# EAGLE design DIGI PTT CW (EAGLE 7.6.0)
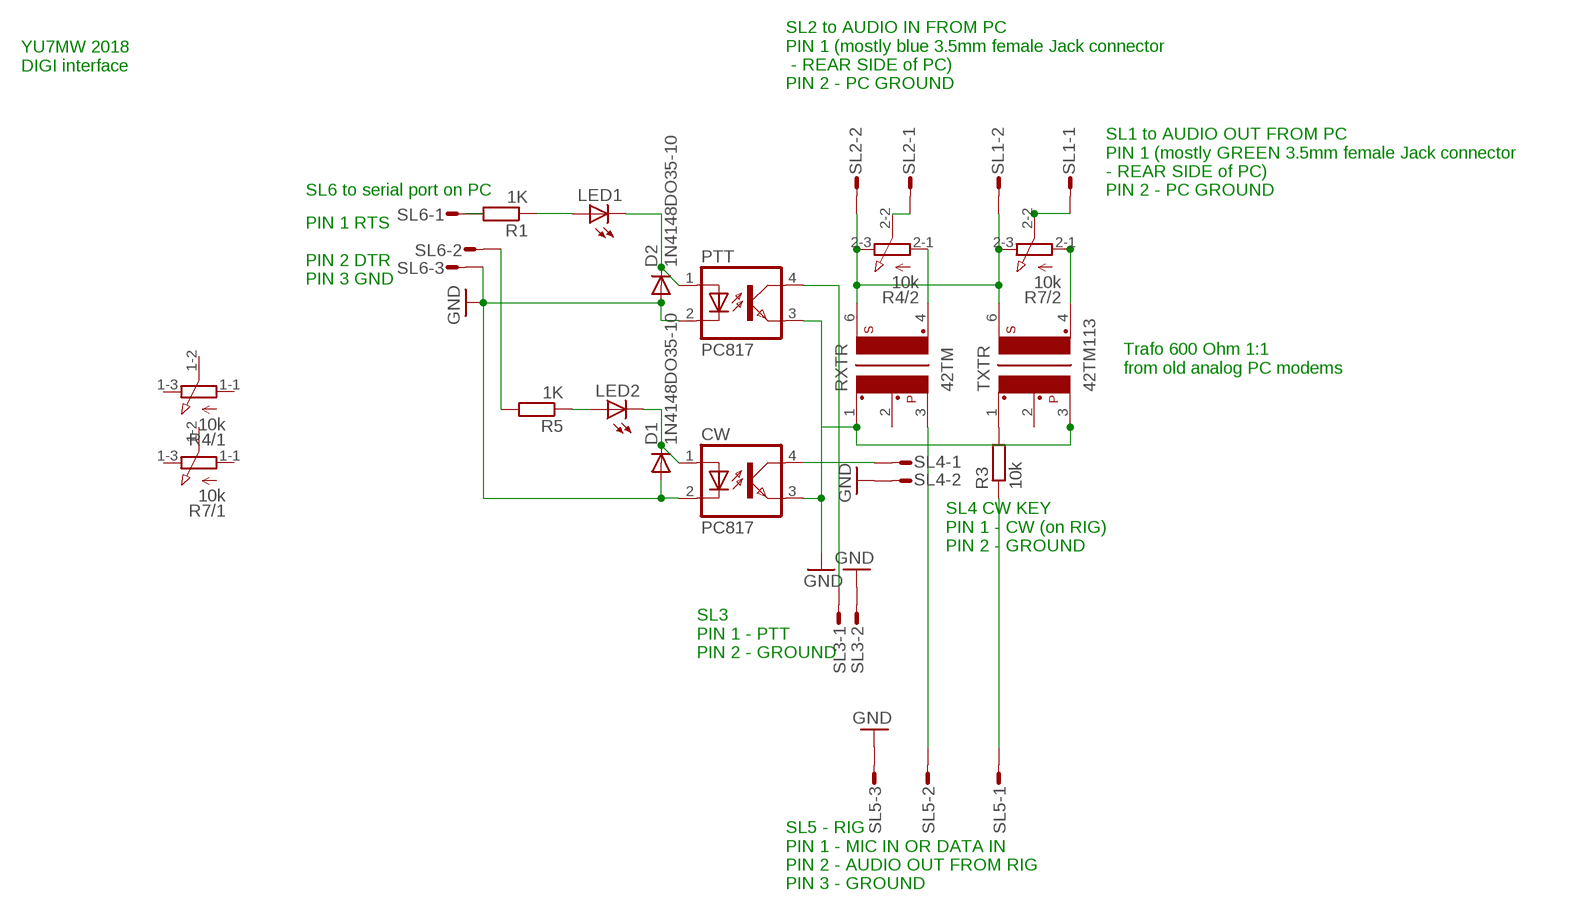
[diagram p0: schematic, sheet 1]

## Parts
CW  PC817  [DIL04]
D1  1N4148DO35-10  [DO35-10]
D2  1N4148DO35-10  [DO35-10]
LED1  LED3MM  [LED3MM]
LED2  LED3MM  [LED3MM]
PTT  PC817  [DIL04]
R1  1K  R-EU_0207/10  [0207/10]
R3  10k  R-EU_0207/10  [0207/10]
R4  10k  3RP/1610G  [3RP/1610G]
R5  1K  R-EU_0207/10  [0207/10]
R7  10k  3RP/1610G  [3RP/1610G]
RXTR  42TM  42TM113  [42TM]
SL1  M02S  [02P]
SL2  M02S  [02P]
SL3  M02S  [02P]
SL4  M02S  [02P]
SL5  M03S  [03P]
SL6  M03S  [03P]
TXTR  42TM113  [42TM]

## Nets
GND: CW.2(C) CW.3(EMIT) D1.A D2.A PTT.2(C) PTT.3(EMIT) RXTR.1 SL3.2 SL4.2 SL5.3 SL6.3 TXTR.3
N$1: LED1.A R1.1
N$2: R5.2 SL6.2
N$3: CW.1(A) D1.C LED2.K(C)
N$4: CW.4(COL) SL4.1
N$5: RXTR.3 SL5.2
N$6: R3.1 SL5.1
N$7: R4.2-2(/2:S) SL2.1
N$8: R4.2-3(/2:E) R7.2-3(/2:E) RXTR.6 SL1.2 SL2.2 TXTR.6
N$9: R3.2 TXTR.1
N$10: R1.2 SL6.1
N$11: R4.2-1(/2:A) RXTR.4
N$12: R7.2-2(/2:S) SL1.1
N$13: LED2.A R5.1
N$14: R7.2-1(/2:A) TXTR.4
N$23: D2.C LED1.K(C) PTT.1(A)
N$25: PTT.4(COL) SL3.1
Unconnected: R4.1-1(/1:A) R4.1-2(/1:S) R4.1-3(/1:E) R7.1-1(/1:A) R7.1-2(/1:S) R7.1-3(/1:E) RXTR.2 TXTR.2

## Notes on the sheet
- YU7MW 2018
  DIGI interface
- SL2 to AUDIO IN FROM PC 
  PIN 1 (mostly blue 3.5mm female Jack connector
   - REAR SIDE of PC)
  PIN 2 - PC GROUND
- SL6 to serial port on PC
- SL1 to AUDIO OUT FROM PC 
  PIN 1 (mostly GREEN 3.5mm female Jack connector 
  - REAR SIDE of PC)
  PIN 2 - PC GROUND
- PIN 1 RTS
  
  PIN 2 DTR
  PIN 3 GND
- Trafo 600 Ohm 1:1
  from old analog PC modems
- SL4 CW KEY
  PIN 1 - CW (on RIG)
  PIN 2 - GROUND
- SL3
  PIN 1 - PTT
  PIN 2 - GROUND
- SL5 - RIG
  PIN 1 - MIC IN OR DATA IN
  PIN 2 - AUDIO OUT FROM RIG
  PIN 3 - GROUND

## Library data of the parts
CW PTT = optocoupler:PC817: SHARP OPTO COUPLER; MPN: PC817X4J000F; OC_FARNELL: 9707727; OC_NEWARK: 97K7059
D1 D2 = diode:1N4148: DIODE high speed (Philips)
LED1 LED2 = led:LED: LED OSRAM: - CHIPLED LG R971, LG N971, LY N971, LG Q971, LY Q971, LO R971, LY R971 LH N974, LH R974 LS Q976, LO Q976, LY Q976 LO Q996 - Hyper CHIPLED LW Q18S LB Q993, LB Q99A, LB R99A - SideLED LS A670, LO A670, LY A670, LG A670, LP A670 LB A673, LV A673, LT A673, LW A673 LH A674 LY A675 LS A676, LA A676, LO A676, LY A676, LW A676 LS A679, LY A679, LG A679 - Hyper Micro SIDELED® LS Y876, LA Y876, LO Y876, LY Y876 LT Y87S - SmartLED LW L88C, LW L88S LB L89C, LB L89S, LG L890 LS L89K, LO L89K, LY L89K LS L896, LA L896, LO L896, LY L896 - TOPLED LS T670, LO T670, LY T670, LG T670, LP T670 LSG T670, LSP T670, LSY T670, LOP T670, LYG T670 LG T671, LOG T671, LSG T671 LB T673, LV T673, LT T673, LW T673 LH T674 LS T676, LA T676, LO T676, LY T676, LB T676, LH T676, LSB T676, LW T676 LB T67C, LV T67C, LT T67C, LS T67K, LO T67K, LY T67K, LW E67C LS E67B, LA E67B, LO E67B, LY E67B, LB E67C, LV E67C, LT E67C LW T67C LS T679, LY T679, LG T679 LS T770, LO T770, LY T770, LG T770, LP T770 LB T773, LV T773, LT T773, LW T773 LH T774 LS E675, LA E675, LY E675, LS T675 LS T776, LA T776, LO T776, LY T776, LB T776 LHGB T686 LT T68C, LB T68C - Hyper Mini TOPLED® LB M676 - Mini TOPLED Santana® LG M470 LS M47K, LO M47K, LY M47K Source: http://www.osram.convergy.de LUXEON: - LUMILED® LXK2-PW12-R00, LXK2-PW12-S00, LXK2-PW14-U00, LXK2-PW14-V00 LXK2-PM12-R00, LXK2-PM12-S00, LXK2-PM14-U00 LXK2-PE12-Q00, LXK2-PE12-R00, LXK2-PE12-S00, LXK2-PE14-T00, LXK2-PE14-U00 LXK2-PB12-K00, LXK2-PB12-L00, LXK2-PB12-M00, LXK2-PB14-N00, LXK2-PB14-P00, LXK2-PB14-Q00 LXK2-PR12-L00, LXK2-PR12-M00, LXK2-PR14-Q00, LXK2-PR14-R00 LXK2-PD12-Q00, LXK2-PD12-R00, LXK2-PD12-S00 LXK2-PH12-R00, LXK2-PH12-S00 LXK2-PL12-P00, LXK2-PL12-Q00, LXK2-PL12-R00 Source: www.luxeon.com KINGBRIGHT: KA-3528ASYC Source: www.kingbright.com
R1 R3 R5 = resistor:R-EU_: RESISTOR, European symbol
R4 R7 = pot:3RP/1610G: 16mm Potentiometer two level Source: http://www.alphapotentiometers.net/html/16mm_pot_2.html
RXTR TXTR = trafo-xicon:42TM113: Transformer Mouser 42TLM Series Source: http://www.mouser.com/catalog/specsheets/164267.pdf; OC_FARNELL: unknown; OC_NEWARK: unknown
SL1-SL4 = con-amp-quick:M02S: AMP QUICK CONNECTOR; OC_FARNELL: unknown; OC_NEWARK: unknown
SL5 SL6 = con-amp-quick:M03S: AMP QUICK CONNECTOR; OC_FARNELL: unknown; OC_NEWARK: unknown

## Board
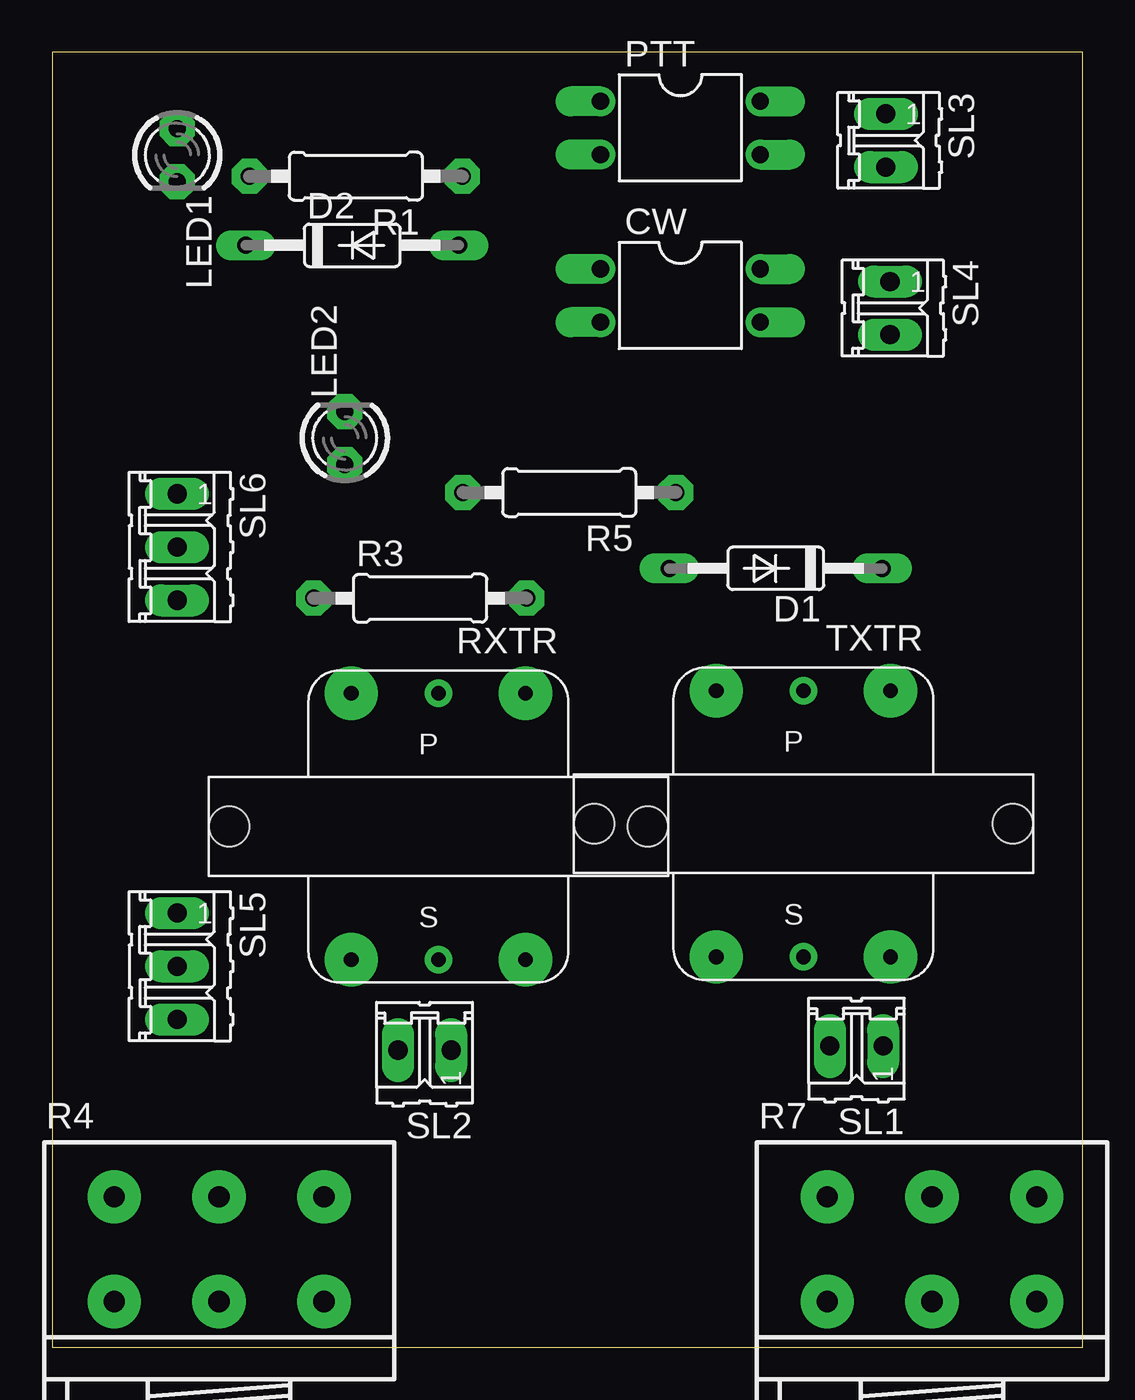
[diagram p1: board, top side]
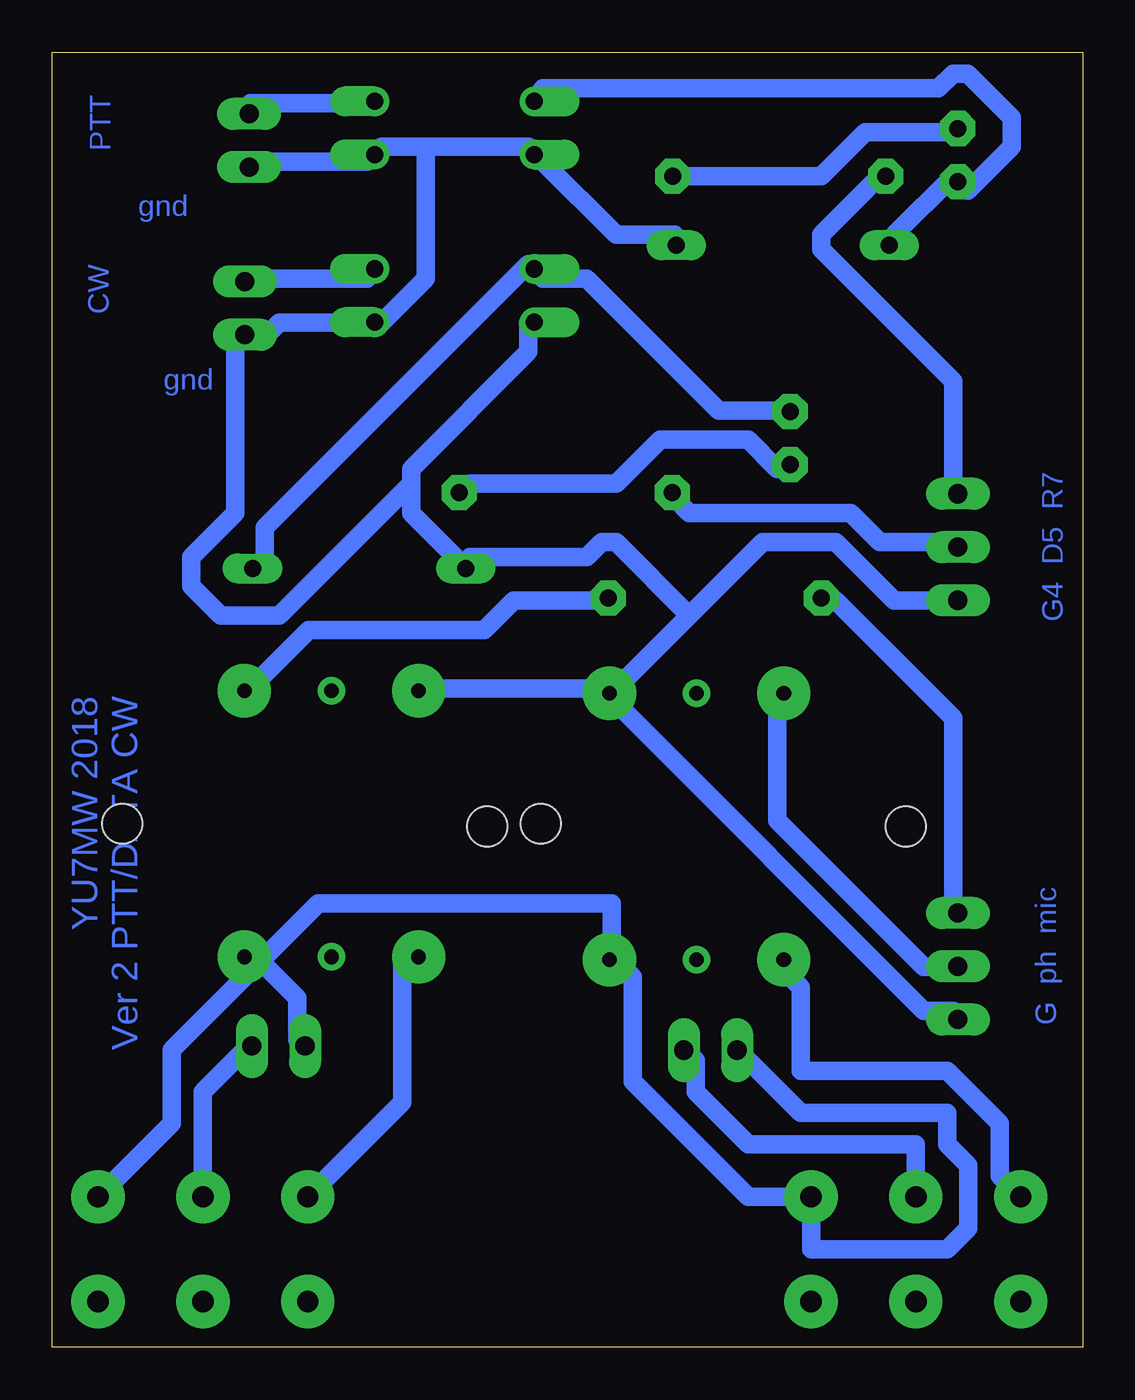
[diagram p2: board, bottom side, seen from below]

Size 49.13 x 61.77 mm. Coordinates in mm from the lower left corner, seen from the top.
Outline: 0,0 49.13,0 49.13,61.77 0,61.77 0,0
Copper layers (1*16): Top 0.035mm / dielectric 1.5mm / Bottom 0.035mm
Design rules "boki2 *": minimum track width 35mil, minimum drill 20mil, track to track 20mil, track to pad 30mil, pad to pad 8mil, via to via 8mil, smd to smd 8mil, copper to edge 10mil, drill to drill 8mil, minimum pad ring 12mil, minimum via ring 10mil, stop-mask expansion 4mil, vias tented up to drill 25mil, thermal gap 10mil

### Footprints (pad centres in the part's own frame; a part is rotated, then mirrored left to right if it is on the bottom)
DIL04 = drill 0.813 offset: 1 -1.27,-3.81; 2 1.27,-3.81; 3 1.27,3.81; 4 -1.27,3.81
DO35-10 = drill 0.813 long: A 5.08,0; C -5.08,0
LED3MM = drill 0.813 pad 1.676 octagon: A -1.27,0; K 1.27,0
0207/10 = drill 0.813 pad 1.676 octagon: 1 -5.08,0; 2 5.08,0
3RP/1610G = drill 1.016 pad 2.54: 1-1 -5,0; 1-2 0,0; 1-3 5,0; 2-1 -5,5; 2-2 0,5; 2-3 5,5
42TM = drill 0.7 pad 2.54: 1 -4.156,-6.35; 3 4.156,-6.35; 4 4.156,6.35; 6 -4.156,6.35 | drill 0.7 pad 1.3: 2 0,-6.35; 5 0,6.35 | hole 1.9: -9.982,0; 9.982,0
02P = drill 0.914 long: 1 -1.27,0; 2 1.27,0
03P = drill 0.914 long: 1 -2.54,0; 2 0,0; 3 2.54,0

### Placement (x,y rotation side)
CW  29.95,50.17 270 top
D1  34.5,37.15 180 top
D2  14.3,52.57 0 top
LED1  5.95,56.87 270 top
LED2  13.95,43.37 90 top
PTT  29.95,58.17 270 top
R1  14.47,55.86 180 top
R3  17.54,35.73 0 top
R4  7.95,2.17 0 top
R5  24.65,40.77 180 top
R7  41.95,2.17 0 top
RXTR  18.41,24.84 180 top
SL1  38.35,14.37 180 top
SL2  17.75,14.17 180 top
SL3  39.75,57.57 270 top
SL4  39.95,49.57 270 top
SL5  5.95,18.17 270 top
SL6  5.95,38.17 270 top
TXTR  35.82,24.97 180 top

### Tracks (layer width: path | path; a pad name or v marks a point on that pad's centre or on a via)
GND
  Bottom 0.889: RXTR.1 22.24,30.72 7.57,16.05 6.18,16.05 SL5.3 | D2.A 19.45,53.07 22.24,53.07 25.73,56.56 PTT.2 26.43,57.26 31.32,57.26 | SL3.2 39.7,56.56 34.12,56.56 PTT.3 33.42,57.26 31.32,57.26 | 31.32,57.26 31.32,50.98 33.42,48.88 CW.3 34.12,48.88 38.31,48.88 39.01,48.18 39.7,48.18 SL4.2 40.4,48.18 40.4,39.8 42.5,37.7 42.5,36.31 41.1,34.91 38.31,34.91 32.02,41.2 | 32.02,41.2 32.02,39.8 29.93,37.7 D1.A 29.23,37.7 23.64,37.7 22.94,38.4 22.24,38.4 18.75,34.91 | 32.02,41.2 32.02,41.89 26.43,47.48 26.43,48.88 CW.2 | RXTR.1 22.94,31.42 31.32,31.42 TXTR.3 | 18.75,34.91 22.24,31.42 RXTR.1 | 18.75,34.91 15.26,38.4 11.76,38.4 8.97,35.61 6.18,35.61 SL6.3
N$1
  Bottom 0.889: R1.1 19.45,55.86 12.46,55.86 10.37,57.96 6.18,57.96 LED1.A
N$2
  Bottom 0.889: SL6.2 6.18,38.4 9.67,38.4 11.07,39.8 18.75,39.8 19.45,40.5 R5.2
N$3
  Bottom 0.889: D1.C 39.01,37.7 39.01,39.1 26.43,51.67 CW.1 25.73,50.98 23.64,50.98 17.35,44.69 14.56,44.69 LED2.K
N$4
  Bottom 0.889: CW.4 34.12,50.98 39.7,50.98 SL4.1
N$5
  Bottom 0.889: SL5.2 6.18,18.15 7.57,18.15 14.56,25.13 14.56,30.72 RXTR.3
N$6
  Bottom 0.889: SL5.1 6.18,20.94 6.18,30.02 11.76,35.61 R3.1
N$7
  Bottom 0.889: R4.2-2 7.95,9.67 15.95,9.67 18.45,12.17 18.45,13.67 18.95,14.17 SL2.1
N$8
  Bottom 0.889: SL1.2 37.45,14.67 37.45,16.67 38.95,18.17 TXTR.6 | R7.2-3 43.45,10.67 43.45,14.17 39.45,18.17 TXTR.6 | SL2.2 16.45,14.17 13.45,11.17 6.45,11.17 6.45,9.67 5.45,8.67 5.45,5.67 6.45,4.67 12.95,4.67 R4.2-3 15.95,7.17 21.45,12.67 21.45,17.67 21.95,18.17 RXTR.6 22.45,18.67 22.45,21.17 36.45,21.17 38.95,18.67 TXTR.6
N$9
  Bottom 0.889: R3.2 22.94,35.61 27.13,35.61 28.53,34.21 36.91,34.21 39.7,31.42 TXTR.1
N$10
  Bottom 0.889: SL6.1 6.18,41.2 6.18,46.09 12.46,52.37 12.46,53.07 9.67,55.86 R1.2
N$11
  Bottom 0.889: R4.2-1 3.95,8.17 3.95,10.67 6.45,13.17 13.45,13.17 13.45,17.17 14.45,18.17 RXTR.4
N$12
  Bottom 0.889: R7.2-2 41.95,12.17 39.95,14.17 SL1.1
N$13
  Bottom 0.889: R5.1 29.23,41.2 22.24,41.2 20.15,43.29 15.96,43.29 14.56,41.89 LED2.A
N$14
  Bottom 0.889: R7.2-1 32.45,11.67 32.45,18.17 TXTR.4
N$23
  Bottom 0.889: D2.C 8.97,53.07 6.18,55.86 LED1.K 5.48,55.17 3.38,57.26 3.38,58.66 5.48,60.75 6.18,60.75 6.87,60.06 25.73,60.06 PTT.1
N$25
  Bottom 0.889: PTT.4 34.12,59.36 39.7,59.36 SL3.1

### Text on the board
Bottom: PTT | gnd | CW | gnd | G4 D5 R7 | YU7MW 2018 / Ver 2 PTT/DATA CW | G ph mic